# EAGLE design ADAPT (EAGLE 9.4.2)
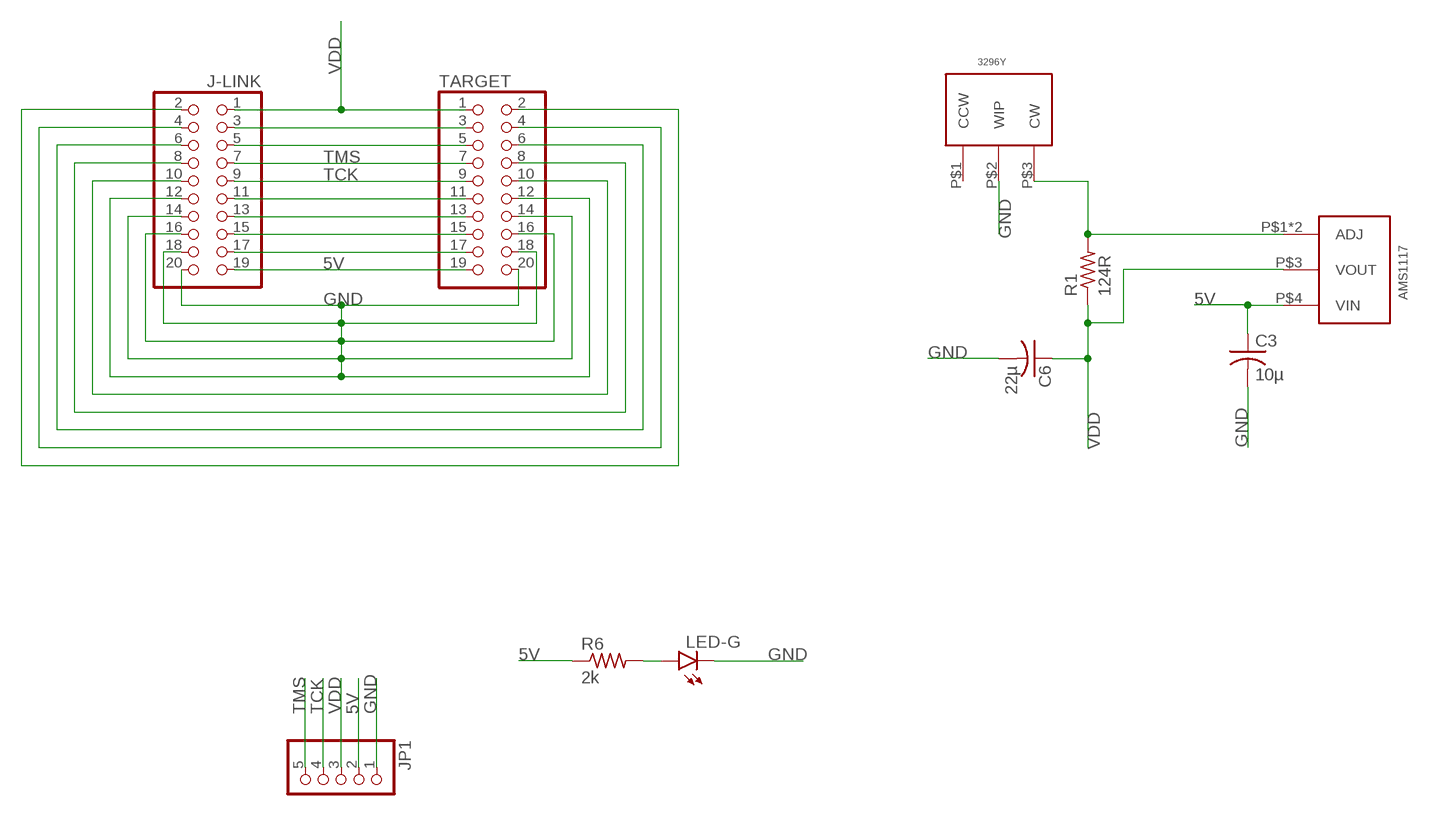
[diagram p0: schematic, sheet 1]

## Parts
3296Y  3296Y  [3296Y]
AMS1117  AMS1117  [AMS1117]
C3  10µ  C-USC1206  [C1206]
C6  22µ  C-USC1206  [C1206]
J-LINK  PINHD-2X10  [2X10]
JP1  PINHD-1X5  [1X05]
LED-G  LEDCHIPLED_0603  [CHIPLED_0603]
R1  124R  R-US_R0805  [R0805]
R6  2k  R-US_R0603  [R0603]
TARGET  PINHD-2X10  [2X10]

## Nets
5V: AMS1117.P$4(VIN) C3.1 J-LINK.19 JP1.2 R6.1 TARGET.19
GND: 3296Y.P$2(WIP) C3.2 C6.2 J-LINK.12 J-LINK.14 J-LINK.16 J-LINK.18 J-LINK.20 JP1.1 LED-G.C TARGET.12 TARGET.14 TARGET.16 TARGET.18 TARGET.20
N$1: J-LINK.3 TARGET.3
N$2: J-LINK.5 TARGET.5
N$3: 3296Y.P$3(CW) AMS1117.P$1(ADJ) AMS1117.P$2(ADJ) R1.2
N$5: J-LINK.11 TARGET.11
N$6: J-LINK.13 TARGET.13
N$7: J-LINK.15 TARGET.15
N$8: J-LINK.17 TARGET.17
N$15: J-LINK.10 TARGET.10
N$16: J-LINK.8 TARGET.8
N$17: J-LINK.6 TARGET.6
N$18: J-LINK.4 TARGET.4
N$19: J-LINK.2 TARGET.2
N$38: LED-G.A R6.2
TCK: J-LINK.9 JP1.4 TARGET.9
TMS: J-LINK.7 JP1.5 TARGET.7
VDD: AMS1117.P$3(VOUT) C6.1 J-LINK.1 JP1.3 R1.1 TARGET.1
Unconnected: 3296Y.P$1(CCW)

## Library data of the parts
3296Y = CanCubeSat:3296Y
AMS1117 = CanCubeSat:AMS1117
C3 C6 = rcl:C-US: CAPACITOR, American symbol; SPICEPREFIX: C
J-LINK = CanCubeSat:PINHD-2X10: PIN HEADER
JP1 = pinheadCS:PINHD-1X5: PIN HEADER
LED-G = led:LED: LED OSRAM: - CHIPLED LG R971, LG N971, LY N971, LG Q971, LY Q971, LO R971, LY R971 LH N974, LH R974 LS Q976, LO Q976, LY Q976 LO Q996 - Hyper CHIPLED LW Q18S LB Q993, LB Q99A, LB R99A - SideLED LS A670, LO A670, LY A670, LG A670, LP A670 LB A673, LV A673, LT A673, LW A673 LH A674 LY A675 LS A676, LA A676, LO A676, LY A676, LW A676 LS A679, LY A679, LG A679 - Hyper Micro SIDELED® LS Y876, LA Y876, LO Y876, LY Y876 LT Y87S - SmartLED LW L88C, LW L88S LB L89C, LB L89S, LG L890 LS L89K, LO L89K, LY L89K LS L896, LA L896, LO L896, LY L896 - TOPLED LS T670, LO T670, LY T670, LG T670, LP T670 LSG T670, LSP T670, LSY T670, LOP T670, LYG T670 LG T671, LOG T671, LSG T671 LB T673, LV T673, LT T673, LW T673 LH T674 LS T676, LA T676, LO T676, LY T676, LB T676, LH T676, LSB T676, LW T676 LB T67C, LV T67C, LT T67C, LS T67K, LO T67K, LY T67K, LW E67C LS E67B, LA E67B, LO E67B, LY E67B, LB E67C, LV E67C, LT E67C LW T67C LS T679, LY T679, LG T679 LS T770, LO T770, LY T770, LG T770, LP T770 LB T773, LV T773, LT T773, LW T773 LH T774 LS E675, LA E675, LY E675, LS T675 LS T776, LA T776, LO T776, LY T776, LB T776 LHGB T686 LT T68C, LB T68C - Hyper Mini TOPLED® LB M676 - Mini TOPLED Santana® LG M470 LS M47K, LO M47K, LY M47K Source: http://www.osram.convergy.de LUXEON: - LUMILED® LXK2-PW12-R00, LXK2-PW12-S00, LXK2-PW14-U00, LXK2-PW14-V00 LXK2-PM12-R00, LXK2-PM12-S00, LXK2-PM14-U00 LXK2-PE12-Q00, LXK2-PE12-R00, LXK2-PE12-S00, LXK2-PE14-T00, LXK2-PE14-U00 LXK2-PB12-K00, LXK2-PB12-L00, LXK2-PB12-M00, LXK2-PB14-N00, LXK2-PB14-P00, LXK2-PB14-Q00 LXK2-PR12-L00, LXK2-PR12-M00, LXK2-PR14-Q00, LXK2-PR14-R00 LXK2-PD12-Q00, LXK2-PD12-R00, LXK2-PD12-S00 LXK2-PH12-R00, LXK2-PH12-S00 LXK2-PL12-P00, LXK2-PL12-Q00, LXK2-PL12-R00 Source: www.luxeon.com KINGBRIGHT: KA-3528ASYC Source: www.kingbright.com
R1 = rcl:R-US_: RESISTOR, American symbol; SPICEPREFIX: R
R6 = resistor:R-US_: RESISTOR, American symbol
TARGET = pinheadCS:PINHD-2X10: PIN HEADER

## Board
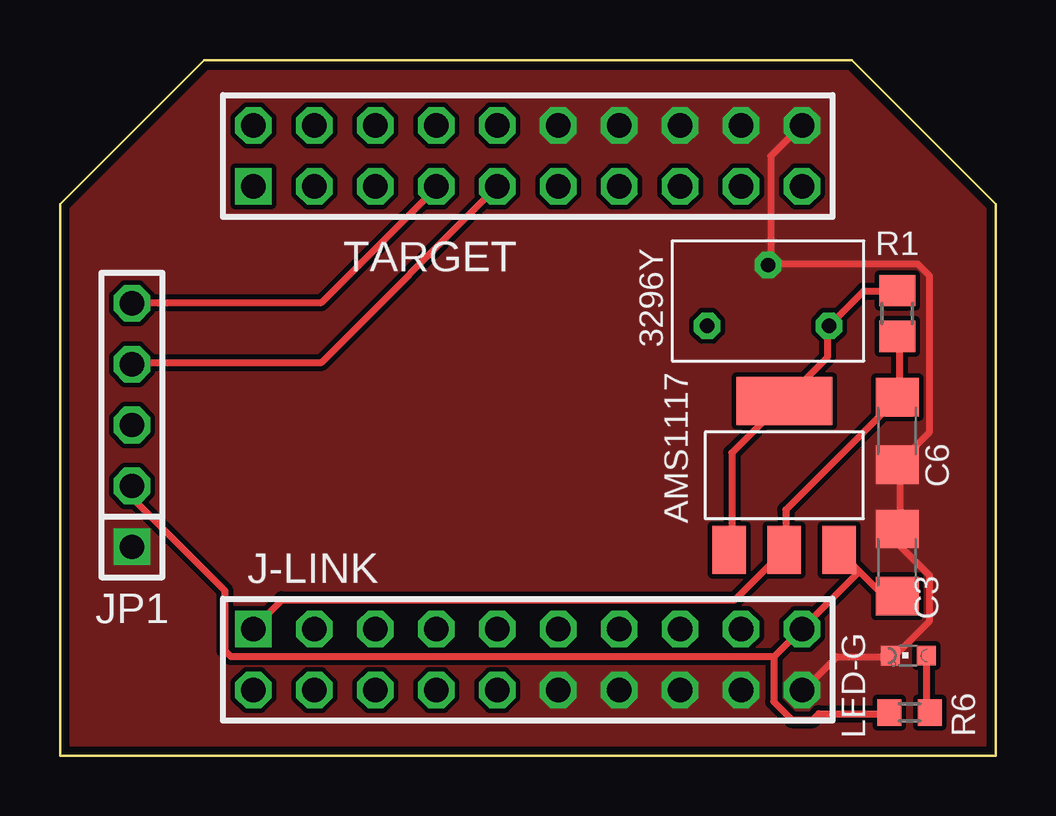
[diagram p1: board, top side]
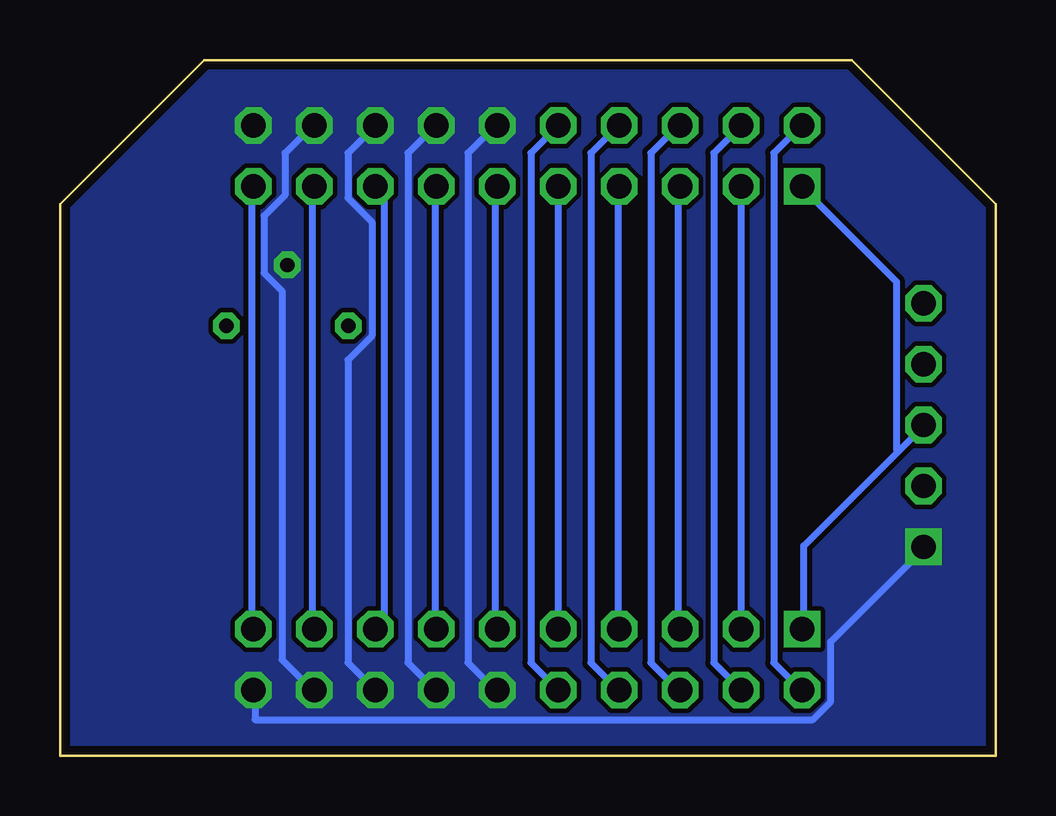
[diagram p2: board, bottom side, seen from below]

Size 39 x 29 mm. Coordinates in mm from the lower left corner, seen from the top.
Outline: 0,0 39,0 39,23 33,29 6,29 0,23 0,0
Copper layers (1*16): Top 0.035mm / dielectric 1.5mm / Bottom 0.035mm
Design rules "default *": minimum track width 0.3mm, minimum drill 0.35mm, track to track 0.2mm, track to pad 0.2mm, pad to pad 0.2mm, via to via 0.2mm, smd to smd 0.2mm, copper to edge 0.35mm, drill to drill 6mil, minimum pad ring 10mil, minimum via ring 8mil, stop-mask expansion 4mil, vias tented up to drill 0mil, thermal gap 10mil

### Footprints (pad centres in the part's own frame; a part is rotated, then mirrored left to right if it is on the bottom)
3296Y = drill 0.6 octagon: P$1 -2.54,-2.54; P$2 0,0; P$3 2.54,-2.54
AMS1117 = smd 4 x 2: P$1 0,3.1 | smd 1.4 x 2: P$2 -2.29,-3.1; P$3 0,-3.1; P$4 2.29,-3.1
C1206 = smd 1.6 x 1.8: 1 -1.4,0; 2 1.4,0
2X10 = drill 1.016 square: 1 -11.43,1.27 | drill 1.016 octagon: 2 -11.43,-1.27; 3 -8.89,1.27; 4 -8.89,-1.27; 5 -6.35,1.27; 6 -6.35,-1.27; 7 -3.81,1.27; 8 -3.81,-1.27; 9 -1.27,1.27; 10 -1.27,-1.27; 11 1.27,1.27; 12 1.27,-1.27; 13 3.81,1.27; 14 3.81,-1.27; 15 6.35,1.27; 16 6.35,-1.27; 17 8.89,1.27; 18 8.89,-1.27; 19 11.43,1.27; 20 11.43,-1.27
1X05 = drill 1.016 square: 1 -5.08,0 | drill 1.016 octagon: 2 -2.54,0; 3 0,0; 4 2.54,0; 5 5.08,0
CHIPLED_0603 = smd 0.8 x 0.8: A 0,-0.75; C 0,0.75
R0805 = smd 1.3 x 1.5: 1 -0.95,0; 2 0.95,0
R0603 = smd 1 x 1.1: 1 -0.85,0; 2 0.85,0
2X10' = drill 1.016 square: 1 -11.43,-1.27 | drill 1.016 octagon: 2 -11.43,1.27; 3 -8.89,-1.27; 4 -8.89,1.27; 5 -6.35,-1.27; 6 -6.35,1.27; 7 -3.81,-1.27; 8 -3.81,1.27; 9 -1.27,-1.27; 10 -1.27,1.27; 11 1.27,-1.27; 12 1.27,1.27; 13 3.81,-1.27; 14 3.81,1.27; 15 6.35,-1.27; 16 6.35,1.27; 17 8.89,-1.27; 18 8.89,1.27; 19 11.43,-1.27; 20 11.43,1.27

### Placement (x,y rotation side)
3296Y  29.52,20.45 0 top
AMS1117  30.19,11.68 0 top
C3  34.9,8.05 90 top
C6  34.9,13.53 270 top
J-LINK  19.5,4 0 top
JP1  3,13.78 90 top
LED-G  35.36,4.17 90 top
R1  34.9,18.43 90 top
R6  35.42,1.8 0 top
TARGET  [2X10']  19.5,25 0 top

### Tracks (layer width: path | path; a pad name or v marks a point on that pad's centre or on a via)
5V
  Top 0.3: 33.31,7.69 32.5,8.5 AMS1117.P$4 | 33.31,7.69 34.25,6.75 34.88,6.75 C3.1 | 29.75,4.12 29.75,2.25 30.5,1.5 31.38,1.5 31.62,1.75 34.5,1.75 R6.1 | 29.75,4.12 30.88,5.25 J-LINK.19 31,5.38 33.31,7.69 | JP1.2 3,10.75 6.88,6.88 6.88,4.38 7.12,4.12 29.75,4.12
  Bottom 0.3: TARGET.19 31,23.62 31,5.38 J-LINK.19
GND
  Top 0.3: TARGET.20 30.88,26.25 29.62,25 29.62,20.5 3296Y.P$2 29.75,20.5 35.75,20.5 36.25,20 36.25,13.5 35,12.25 C6.2 35,12.12 35,9.5 C3.2 35,9.38 35,8.75 36.25,7.5 36.25,5.62 34.75,4.12 LED-G.C 34.5,4.12 32.38,4.12 31,2.75 J-LINK.20
  Bottom 0.3: JP1.1 3,8.62 6.88,4.75 6.88,2.25 7.62,1.5 30.88,1.5 30.88,2.62 J-LINK.20 | J-LINK.18 28.5,2.75 29.75,4 29.75,19.38 30.5,20.12 30.5,22.5 29.62,23.38 29.62,25.12 28.5,26.25 TARGET.18 | J-LINK.16 25.88,2.75 27,3.88 27,16.5 26,17.5 26,22.25 27,23.25 27,25.12 25.88,26.25 TARGET.16 | J-LINK.14 23.38,2.75 24.5,3.88 24.5,25.12 23.38,26.25 TARGET.14 | J-LINK.12 20.88,2.75 22,3.88 22,25.12 20.88,26.25 TARGET.12
  pour Top (no thermals): 0,0 0,23 6,29 33,29 39,23 39,0
  pour Bottom (no thermals): 0,0 0,23 6,29 33,29 39,23 39,0
N$1
  Bottom 0.3: J-LINK.3 10.62,5.38 10.62,23.62 TARGET.3
N$2
  Bottom 0.3: J-LINK.5 13.25,5.38 13.25,23.62 TARGET.5
N$3
  Top 0.3: R1.2 34.88,19.38 33.5,19.38 32.12,18 3296Y.P$3 32,17.88 32,16.62 30.25,14.88 AMS1117.P$1 30.12,14.75 28,12.62 28,8.62 AMS1117.P$2
N$5
  Bottom 0.3: J-LINK.11 20.88,5.38 20.88,23.62 TARGET.11
N$6
  Bottom 0.3: J-LINK.13 23.38,5.38 23.38,23.62 TARGET.13
N$7
  Bottom 0.3: J-LINK.15 25.75,5.38 25.5,5.62 25.5,23.38 25.75,23.62 TARGET.15
N$8
  Bottom 0.3: J-LINK.17 28.5,5.38 28.5,23.62 TARGET.17
N$15
  Bottom 0.3: J-LINK.10 19.38,3.88 19.38,25.12 TARGET.10
N$16
  Bottom 0.3: J-LINK.8 15.75,2.75 16.88,3.88 16.88,25.12 15.75,26.25 TARGET.8
N$17
  Bottom 0.3: J-LINK.6 13.25,2.75 14.38,3.88 14.38,25.12 13.25,26.25 TARGET.6
N$18
  Bottom 0.3: J-LINK.4 10.62,2.75 11.75,3.88 11.75,25.12 10.62,26.25 TARGET.4
N$19
  Bottom 0.3: J-LINK.2 8.12,2.75 9.25,3.88 9.25,25.12 8.12,26.25 TARGET.2
N$38
  Top 0.3: LED-G.A 36.12,4.12 36.12,2 36.25,1.88 R6.2
TCK
  Top 0.3: TARGET.9 10.88,16.38 3,16.38 JP1.4
  Bottom 0.3: J-LINK.9 18.25,5.38 18.25,23.62 TARGET.9
TMS
  Top 0.3: JP1.5 3,18.88 10.88,18.88 15.62,23.62 TARGET.7
  Bottom 0.3: J-LINK.7 15.75,5.38 15.75,23.62 TARGET.7
VDD
  Top 0.3: R1.1 35,17.38 35,15 C6.1 34.88,14.88 30.25,10.25 30.25,8.62 AMS1117.P$3 30.12,8.5 28.12,6.5 9.25,6.5 8.12,5.38 J-LINK.1
  Bottom 0.3: 4.06,12.69 8,8.75 8,5.38 J-LINK.1 | 4.06,12.69 3,13.75 JP1.3 | TARGET.1 8,23.62 4.12,19.75 4.12,12.75 4.06,12.69